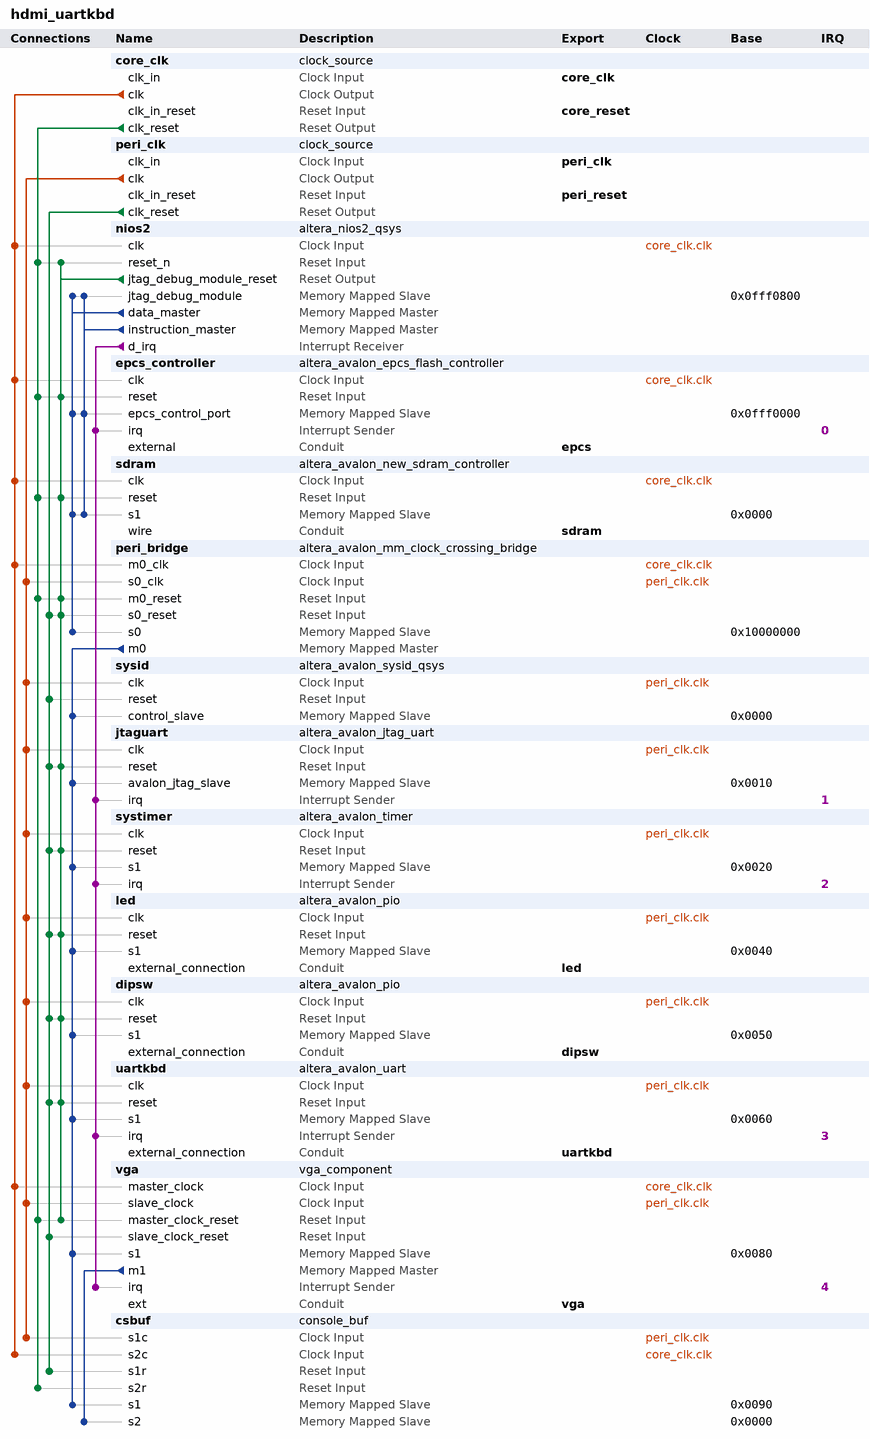
[diagram p0: system contents]
# Platform Designer (Qsys) system hdmi_uartkbd, Cyclone IV E EP4CE22F17C6
# Parameters at their usual value, and those the tool derives, are not listed.
package require -exact qsys 13.0.1.99.2
create_system hdmi_uartkbd
set_project_property DEVICE_FAMILY {Cyclone IV E}
set_project_property DEVICE EP4CE22F17C6

add_instance core_clk clock_source 13.0
set_instance_parameter_value core_clk clockFrequency 50000000

add_instance peri_clk clock_source 13.0
set_instance_parameter_value peri_clk clockFrequency 4000000

add_instance nios2 altera_nios2_qsys 13.0
set_instance_parameter_value nios2 resetSlave epcs_controller.epcs_control_port
set_instance_parameter_value nios2 mmu_TLBMissExcSlave None
set_instance_parameter_value nios2 exceptionSlave sdram.s1
set_instance_parameter_value nios2 breakSlave nios2.jtag_debug_module
set_instance_parameter_value nios2 impl Small
set_instance_parameter_value nios2 icache_size 4096

add_instance epcs_controller altera_avalon_epcs_flash_controller 13.0.1.99.2

add_instance sdram altera_avalon_new_sdram_controller 13.0.1.99.2
set_instance_parameter_value sdram TAC 5.5
set_instance_parameter_value sdram TRCD 20.0
set_instance_parameter_value sdram TRP 20.0
set_instance_parameter_value sdram casLatency 3
set_instance_parameter_value sdram columnWidth 9
set_instance_parameter_value sdram dataWidth 16
set_instance_parameter_value sdram generateSimulationModel false
set_instance_parameter_value sdram model single_Micron_MT48LC4M32B2_7_chip
set_instance_parameter_value sdram numberOfBanks 4
set_instance_parameter_value sdram numberOfChipSelects 1
set_instance_parameter_value sdram powerUpDelay 100.0
set_instance_parameter_value sdram refreshPeriod 15.625
set_instance_parameter_value sdram rowWidth 13

add_instance peri_bridge altera_avalon_mm_clock_crossing_bridge 13.0
set_instance_parameter_value peri_bridge DATA_WIDTH 32
set_instance_parameter_value peri_bridge ADDRESS_WIDTH 12
set_instance_parameter_value peri_bridge MAX_BURST_SIZE 1
set_instance_parameter_value peri_bridge COMMAND_FIFO_DEPTH 4
set_instance_parameter_value peri_bridge RESPONSE_FIFO_DEPTH 4
set_instance_parameter_value peri_bridge MASTER_SYNC_DEPTH 2
set_instance_parameter_value peri_bridge SLAVE_SYNC_DEPTH 2

add_instance sysid altera_avalon_sysid_qsys 13.0
set_instance_parameter_value sysid id 0

add_instance jtaguart altera_avalon_jtag_uart 13.0.1.99.2
set_instance_parameter_value jtaguart simInteractiveOptions NO_INTERACTIVE_WINDOWS

add_instance systimer altera_avalon_timer 13.0.1.99.2
set_instance_parameter_value systimer alwaysRun true
set_instance_parameter_value systimer fixedPeriod true
set_instance_parameter_value systimer period 1
set_instance_parameter_value systimer periodUnits MSEC
set_instance_parameter_value systimer snapshot false

add_instance led altera_avalon_pio 13.0.1.99.2
set_instance_parameter_value led direction Output
set_instance_parameter_value led width 8

add_instance dipsw altera_avalon_pio 13.0.1.99.2
set_instance_parameter_value dipsw direction Input
set_instance_parameter_value dipsw width 4

add_instance uartkbd altera_avalon_uart 13.0.1.99.2
set_instance_parameter_value uartkbd baud 57600
set_instance_parameter_value uartkbd dataBits 8
set_instance_parameter_value uartkbd fixedBaud true
set_instance_parameter_value uartkbd parity NONE
set_instance_parameter_value uartkbd stopBits 1

add_instance vga vga_component 1.0
set_instance_parameter_value vga LINEOFFSETBYTES 2048
set_instance_parameter_value vga H_TOTAL 1344
set_instance_parameter_value vga H_SYNC 17
set_instance_parameter_value vga H_BACKP 20
set_instance_parameter_value vga H_ACTIVE 1024
set_instance_parameter_value vga V_TOTAL 806
set_instance_parameter_value vga V_SYNC 6
set_instance_parameter_value vga V_BACKP 29
set_instance_parameter_value vga V_ACTIVE 768

add_instance csbuf console_buf 1.0
set_instance_parameter_value csbuf PIXDEPTH 16
set_instance_parameter_value csbuf HW 7
set_instance_parameter_value csbuf VW 6

# connections
add_connection core_clk.clk csbuf.s2c clock
add_connection core_clk.clk epcs_controller.clk clock
add_connection core_clk.clk nios2.clk clock
add_connection core_clk.clk peri_bridge.m0_clk clock
add_connection core_clk.clk sdram.clk clock
add_connection core_clk.clk vga.master_clock clock
add_connection peri_clk.clk csbuf.s1c clock
add_connection peri_clk.clk dipsw.clk clock
add_connection peri_clk.clk jtaguart.clk clock
add_connection peri_clk.clk led.clk clock
add_connection peri_clk.clk peri_bridge.s0_clk clock
add_connection peri_clk.clk sysid.clk clock
add_connection peri_clk.clk systimer.clk clock
add_connection peri_clk.clk uartkbd.clk clock
add_connection peri_clk.clk vga.slave_clock clock
add_connection core_clk.clk_reset csbuf.s2r reset
add_connection core_clk.clk_reset epcs_controller.reset reset
add_connection core_clk.clk_reset nios2.reset_n reset
add_connection core_clk.clk_reset peri_bridge.m0_reset reset
add_connection core_clk.clk_reset sdram.reset reset
add_connection core_clk.clk_reset vga.master_clock_reset reset
add_connection nios2.jtag_debug_module_reset dipsw.reset reset
add_connection nios2.jtag_debug_module_reset epcs_controller.reset reset
add_connection nios2.jtag_debug_module_reset jtaguart.reset reset
add_connection nios2.jtag_debug_module_reset led.reset reset
add_connection nios2.jtag_debug_module_reset nios2.reset_n reset
add_connection nios2.jtag_debug_module_reset peri_bridge.m0_reset reset
add_connection nios2.jtag_debug_module_reset peri_bridge.s0_reset reset
add_connection nios2.jtag_debug_module_reset sdram.reset reset
add_connection nios2.jtag_debug_module_reset systimer.reset reset
add_connection nios2.jtag_debug_module_reset uartkbd.reset reset
add_connection nios2.jtag_debug_module_reset vga.master_clock_reset reset
add_connection peri_clk.clk_reset csbuf.s1r reset
add_connection peri_clk.clk_reset dipsw.reset reset
add_connection peri_clk.clk_reset jtaguart.reset reset
add_connection peri_clk.clk_reset led.reset reset
add_connection peri_clk.clk_reset peri_bridge.s0_reset reset
add_connection peri_clk.clk_reset sysid.reset reset
add_connection peri_clk.clk_reset systimer.reset reset
add_connection peri_clk.clk_reset uartkbd.reset reset
add_connection peri_clk.clk_reset vga.slave_clock_reset reset
add_connection nios2.data_master epcs_controller.epcs_control_port avalon
set_connection_parameter_value nios2.data_master/epcs_controller.epcs_control_port baseAddress 0x0fff0000
add_connection nios2.data_master nios2.jtag_debug_module avalon
set_connection_parameter_value nios2.data_master/nios2.jtag_debug_module baseAddress 0x0fff0800
add_connection nios2.data_master peri_bridge.s0 avalon
set_connection_parameter_value nios2.data_master/peri_bridge.s0 baseAddress 0x10000000
add_connection nios2.data_master sdram.s1 avalon
set_connection_parameter_value nios2.data_master/sdram.s1 baseAddress 0x0000
add_connection nios2.instruction_master epcs_controller.epcs_control_port avalon
set_connection_parameter_value nios2.instruction_master/epcs_controller.epcs_control_port baseAddress 0x0fff0000
add_connection nios2.instruction_master nios2.jtag_debug_module avalon
set_connection_parameter_value nios2.instruction_master/nios2.jtag_debug_module baseAddress 0x0fff0800
add_connection nios2.instruction_master sdram.s1 avalon
set_connection_parameter_value nios2.instruction_master/sdram.s1 baseAddress 0x0000
add_connection peri_bridge.m0 csbuf.s1 avalon
set_connection_parameter_value peri_bridge.m0/csbuf.s1 baseAddress 0x0090
add_connection peri_bridge.m0 dipsw.s1 avalon
set_connection_parameter_value peri_bridge.m0/dipsw.s1 baseAddress 0x0050
add_connection peri_bridge.m0 jtaguart.avalon_jtag_slave avalon
set_connection_parameter_value peri_bridge.m0/jtaguart.avalon_jtag_slave baseAddress 0x0010
add_connection peri_bridge.m0 led.s1 avalon
set_connection_parameter_value peri_bridge.m0/led.s1 baseAddress 0x0040
add_connection peri_bridge.m0 sysid.control_slave avalon
set_connection_parameter_value peri_bridge.m0/sysid.control_slave baseAddress 0x0000
add_connection peri_bridge.m0 systimer.s1 avalon
set_connection_parameter_value peri_bridge.m0/systimer.s1 baseAddress 0x0020
add_connection peri_bridge.m0 uartkbd.s1 avalon
set_connection_parameter_value peri_bridge.m0/uartkbd.s1 baseAddress 0x0060
add_connection peri_bridge.m0 vga.s1 avalon
set_connection_parameter_value peri_bridge.m0/vga.s1 baseAddress 0x0080
add_connection vga.m1 csbuf.s2 avalon
set_connection_parameter_value vga.m1/csbuf.s2 baseAddress 0x0000
add_connection nios2.d_irq epcs_controller.irq interrupt
set_connection_parameter_value nios2.d_irq/epcs_controller.irq irqNumber 0
add_connection nios2.d_irq jtaguart.irq interrupt
set_connection_parameter_value nios2.d_irq/jtaguart.irq irqNumber 1
add_connection nios2.d_irq systimer.irq interrupt
set_connection_parameter_value nios2.d_irq/systimer.irq irqNumber 2
add_connection nios2.d_irq uartkbd.irq interrupt
set_connection_parameter_value nios2.d_irq/uartkbd.irq irqNumber 3
add_connection nios2.d_irq vga.irq interrupt
set_connection_parameter_value nios2.d_irq/vga.irq irqNumber 4

# exported interfaces
add_interface core_clk clock sink
set_interface_property core_clk EXPORT_OF core_clk.clk_in
add_interface core_reset reset sink
set_interface_property core_reset EXPORT_OF core_clk.clk_in_reset
add_interface peri_clk clock sink
set_interface_property peri_clk EXPORT_OF peri_clk.clk_in
add_interface peri_reset reset sink
set_interface_property peri_reset EXPORT_OF peri_clk.clk_in_reset
add_interface epcs conduit end
set_interface_property epcs EXPORT_OF epcs_controller.external
add_interface sdram conduit end
set_interface_property sdram EXPORT_OF sdram.wire
add_interface led conduit end
set_interface_property led EXPORT_OF led.external_connection
add_interface uartkbd conduit end
set_interface_property uartkbd EXPORT_OF uartkbd.external_connection
add_interface dipsw conduit end
set_interface_property dipsw EXPORT_OF dipsw.external_connection
add_interface vga conduit end
set_interface_property vga EXPORT_OF vga.ext

set_interconnect_requirement {$system} qsys_mm.clockCrossingAdapter HANDSHAKE
set_interconnect_requirement {$system} qsys_mm.maxAdditionalLatency 1

save_system hdmi_uartkbd.qsys
